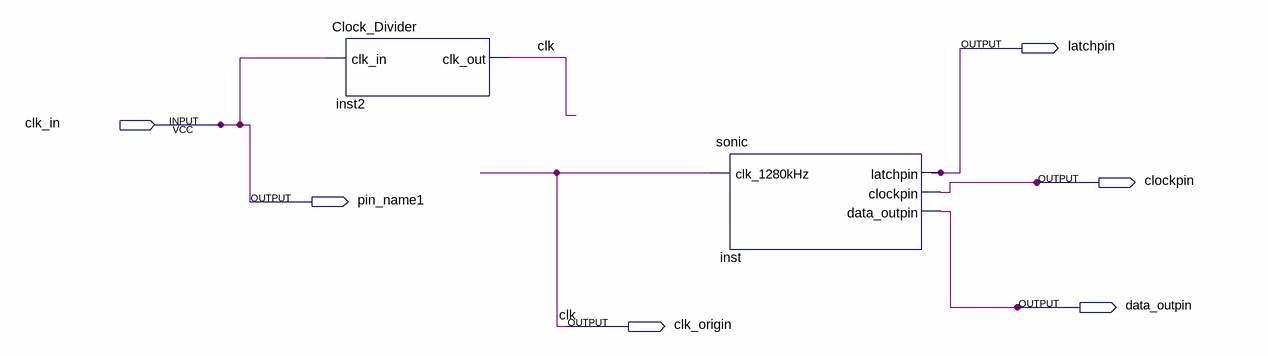
[diagram p0: schematic sheet]
// Quartus schematic Block1.bdf as structural Verilog: 2 symbols, 6 pins
module Block1 (
  input  clk_in,
  output latchpin,
  output clockpin,
  output pin_name1,
  output data_outpin,
  output clk_origin
);

  Clock_Divider inst2 (.clk_in(clk_in), .clk_out(clk_origin));
  sonic inst (.clk_1280kHz(clk_origin), .latchpin(latchpin), .clockpin(clockpin), .data_outpin(data_outpin));

  assign pin_name1 = clk_in;

  // Other names for the same wires on the sheet: clk = clk_origin
endmodule
